# EAGLE schematic Armaz BBB Cape (EAGLE 7.3.0)

## Sheet 1 of 2
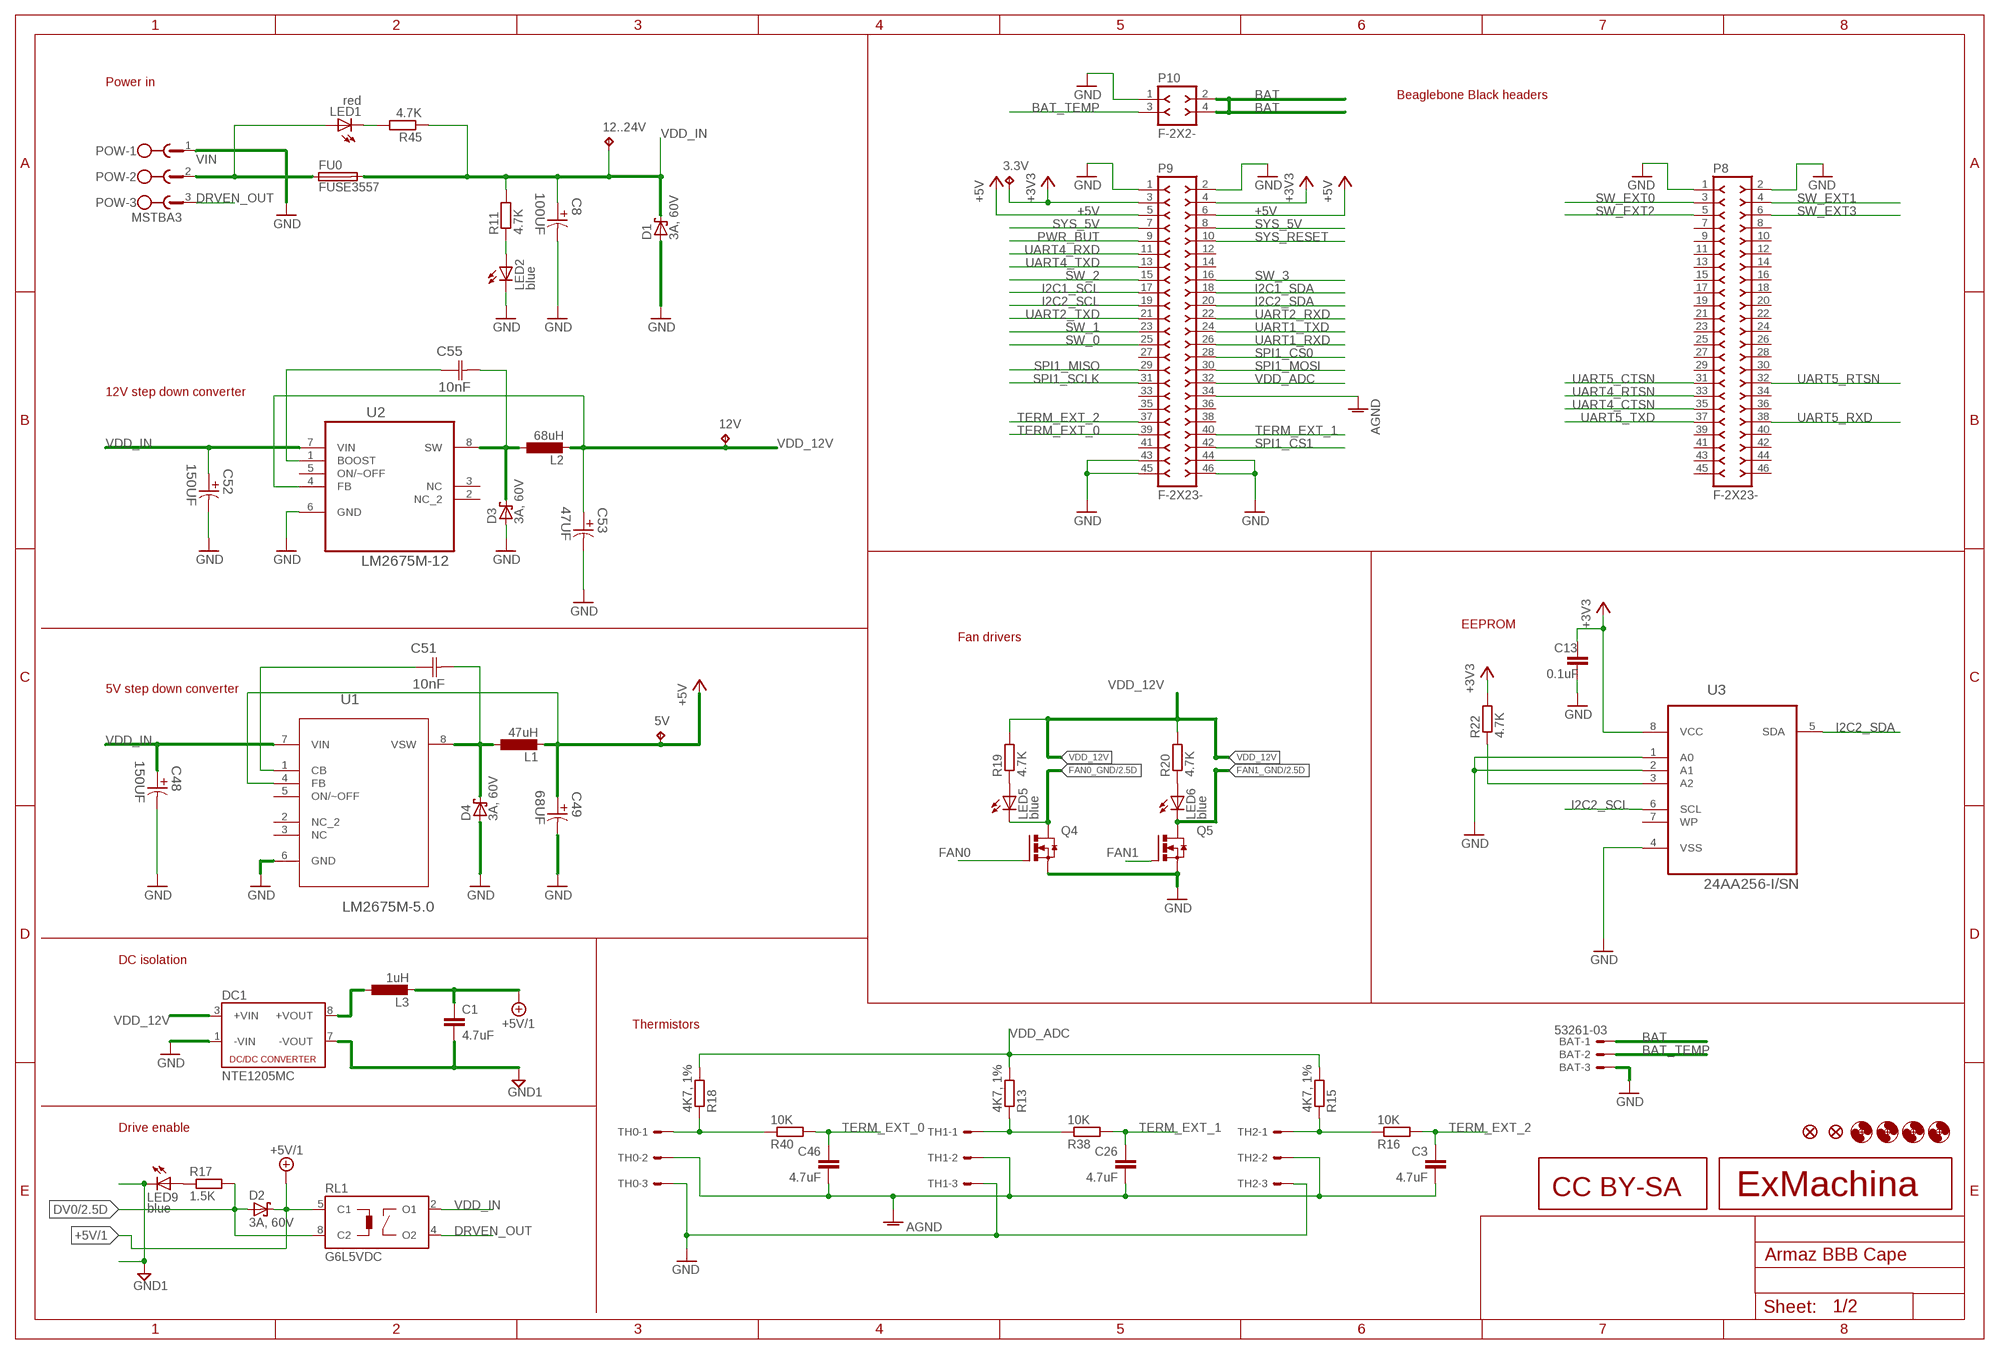
[diagram p0: schematic, sheet 1]

### Parts
3.3V  TPB1,27  [B1,27]
5V  TPB1,27  [B1,27]
12..24V  TPB1,27  [B1,27]
12V  TPB1,27  [B1,27]
BAT  53261-03  [53261-03]
C1  4.7uF  C-EUC0805  [C0805]
C3  4.7uF  C-EUC0402  [C0402]
C8  100UF  EEE-FTH101XAP-CASE-D8  [CAPAE660X800N]
C13  0.1uF  C-EUC0402  [C0402]
C26  4.7uF  C-EUC0402  [C0402]
C46  4.7uF  C-EUC0402  [C0402]
C48  150UF  EEE-FTV151XAP-CASE-D8  [CAPAE660X800N]
C49  68UF  EEE-FT1A680AR-CASE-B  [CAPAE430X610N]
C51  10nF  U0805R103KCT  [CAPC2013X90N]
C52  150UF  EEE-FTV151XAP-CASE-D8  [CAPAE660X800N]
C53  47UF  EEE-FT1E470AR-CASE-C  [CAPAE530X610N]
C55  10nF  U0805R103KCT  [CAPC2013X90N]
D1  3A, 60V  MBRS360BT3G  [SMB]
D2  3A, 60V  MBRS360BT3G  [SMB]
D3  3A, 60V  MBRS360BT3G  [SMB]
D4  3A, 60V  MBRS360BT3G  [SMB]
DC1  NTE1205MC  [NTE]
FU0  FUSE3557  [3557]
H1  MOUNT-HOLE3.3  [3,3]
H2  MOUNT-HOLE3.3  [3,3]
H3  MOUNT-HOLE3.3  [3,3]
H4  MOUNT-HOLE3.3  [3,3]
JP1  FIDUCIAL1X2  [FIDUCIAL-1X2]
JP2  FIDUCIAL1X2  [FIDUCIAL-1X2]
L1  47uH  B82462G4473M000  [B82462G4]
L2  68uH  B82462G4683M000  [B82462G4]
L3  1uH  B82462G4102M000  [B82462G4]
LED1  red  LEDCHIP-LED0603  [CHIP-LED0603]
LED2  blue  LEDCHIP-LED0603  [CHIP-LED0603]
LED5  blue  LEDCHIP-LED0603  [CHIP-LED0603]
LED6  blue  LEDCHIP-LED0603  [CHIP-LED0603]
LED9  blue  LEDCHIP-LED0603  [CHIP-LED0603]
P8  F-2X23-  [DIL-100-2X23]
P9  F-2X23-  [DIL-100-2X23]
P10  F-2X2-  [DIL-100-2X2]
POW  MSTBA3  [MSTBA3]
Q4  IRLML6344TRPBF  [SOT95P240X112-3N]
Q5  IRLML6344TRPBF  [SOT95P240X112-3N]
R11  4.7K  R-EU_R0402  [R0402]
R13  4K7, 1%  R-EU_R0402  [R0402]
R15  4K7, 1%  R-EU_R0402  [R0402]
R16  10K  R-EU_R0402  [R0402]
R17  1.5K  R-EU_R0402  [R0402]
R18  4K7, 1%  R-EU_R0402  [R0402]
R19  4.7K  R-EU_R0402  [R0402]
R20  4.7K  R-EU_R0402  [R0402]
R22  4.7K  R-EU_R0402  [R0402]
R38  10K  R-EU_R0402  [R0402]
R40  10K  R-EU_R0402  [R0402]
R45  4.7K  R-EU_R0402  [R0402]
RL1  G6L5VDC  [G6L-1F]
TH0  22-05-7038-03  [7395-03]
TH1  22-05-7038-03  [7395-03]
TH2  22-05-7038-03  [7395-03]
U1  LM2675M-5.0  [SOIC127P620X175-8N]
U2  LM2675M-12  [SOIC127P600X175-8N]
U3  24AA256-I/SN  [SOIC127P600X175-8N]
U$1  EXMACHINA-LOGO  [EXM-LOGO]
U$2  CC-BY-SA  [CC-BY-SA]

### Nets
$1 [supply]: C51.1(C1) U1.1(CB)
+3V3 [supply]: 3.3V.TP C13.1 P9.3 P9.4 R22.2 U3.8(VCC) ; also sheet 2
+5V [supply]: 5V.TP C49.1 L1.2 P9.5 P9.6 U1.4(FB) ; also sheet 2
+5V/1 [supply]: C1.1 D2.C L3.2 RL1.5(C1) ; also sheet 2
AGND: C3.2 C26.2 C46.2 P9.34 TH0.2 TH1.2 TH2.2
BAT [supply]: BAT.1 P10.2 P10.4
BAT_TEMP: BAT.2 P10.3
DRVEN_OUT [supply]: POW.3 RL1.4(O2)
DV0: D2.A R17.2 RL1.8(C2) ; also sheet 2
FAN0: Q4.1(G) ; also sheet 2
FAN0_GND [supply]: LED5.C Q4.3(D) ; also sheet 2
FAN1: Q5.1(G) ; also sheet 2
FAN1_GND [supply]: LED6.C Q5.3(D) ; also sheet 2
GND [supply]: BAT.3 C8.2 C13.2 C48.2 C49.2 C52.2 C53.2 D1.A D3.A D4.A DC1.1(-VIN) LED2.C P8.1 P8.2 P9.1 P9.2 P9.43 P9.44 P9.45 P9.46 P10.1 POW.1 Q4.2(S) Q5.2(S) TH0.3 TH1.3 TH2.3 U2.6(GND) U3.1(A0) U3.2(A1) U3.4(VSS) ; also sheet 2
GND1 [supply]: C1.2 DC1.7(-VOUT) LED9.C ; also sheet 2
I2C1_SCL: P9.17
I2C1_SDA: P9.18
I2C2_SCL: P9.19 U3.6(SCL) ; also sheet 2
I2C2_SDA: P9.20 U3.5(SDA) ; also sheet 2
N$6: LED9.A R17.1
N$8: LED1.C R45.2
N$9: LED5.A R19.1
N$21 [supply]: DC1.8(+VOUT) L3.1
N$25: R15.1 R16.1 TH2.1
N$96: LED2.A R11.1
N$117: LED6.A R20.1
N$149: R22.1 U3.3(A2)
N$237: R13.1 R38.1 TH1.1
N$240: R18.1 R40.1 TH0.1
N$245: C55.1(C1) U2.1(BOOST)
PWR_BUT: P9.9
SPI1_CS0: P9.28 ; also sheet 2
SPI1_CS1: P9.42
SPI1_MISO: P9.29 ; also sheet 2
SPI1_MOSI: P9.30 ; also sheet 2
SPI1_SCLK: P9.31 ; also sheet 2
SW [supply]: C51.2(C2) D4.C L1.1 U1.8(VSW)
SW_0: P9.25 ; also sheet 2
SW_1: P9.23 ; also sheet 2
SW_2: P9.15 ; also sheet 2
SW_3: P9.16 ; also sheet 2
SW_12V [supply]: C55.2(C2) D3.C L2.1 U2.8(SW)
SW_EXT0: P8.3 ; also sheet 2
SW_EXT1: P8.4 ; also sheet 2
SW_EXT2: P8.5 ; also sheet 2
SW_EXT3: P8.6 ; also sheet 2
SYS_5V [supply]: P9.7 P9.8 ; also sheet 2
SYS_RESET: P9.10 ; also sheet 2
TERM_EXT_0: C46.1 P9.39 R40.2
TERM_EXT_1: C26.1 P9.40 R38.2
TERM_EXT_2: C3.1 P9.37 R16.2
UART1_RXD: P9.26
UART1_TXD: P9.24
UART2_RXD: P9.22
UART2_TXD: P9.21
UART4_CTSN: P8.35
UART4_RTSN: P8.33
UART4_RXD: P9.11 ; also sheet 2
UART4_TXD: P9.13
UART5_CTSN: P8.31
UART5_RTSN: P8.32
UART5_RXD: P8.38 ; also sheet 2
UART5_TXD: P8.37 ; also sheet 2
VDD_12V [supply]: 12V.TP C53.1 DC1.3(+VIN) L2.2 R19.2 R20.2 U2.4(FB) ; also sheet 2
VDD_ADC: P9.32 R13.2 R15.2 R18.2
VDD_IN [supply]: 12..24V.TP C8.1 C48.1 C52.1 D1.C FU0.3 FU0.4 R11.2 R45.1 RL1.2(O1) U1.7(VIN) U2.7(VIN)
VIN [supply]: FU0.1 FU0.2 LED1.A POW.2
Unconnected: P8.7 P8.8 P8.9 P8.10 P8.11 P8.12 P8.13 P8.14 P8.15 P8.16 P8.17 P8.18 P8.19 P8.20 P8.21 P8.22 P8.23 P8.24 P8.25 P8.26 P8.27 P8.28 P8.29 P8.30 P8.34 P8.36 P8.39 P8.40 P8.41 P8.42 P8.43 P8.44 P8.45 P8.46 P9.12 P9.14 P9.27 P9.33 P9.35 P9.36 P9.38 P9.41 U1.2(NC_2) U1.3(NC) U1.5(ON/~OFF) U1.6(GND) U2.2(NC_2) U2.3(NC) U2.5(ON/~OFF) U3.7(WP)

### Notes on the sheet
- Power in
- Beaglebone Black headers
- 12V step down converter
- EEPROM
- Fan drivers
- 5V step down converter
- DC isolation
- Thermistors
- Drive enable

## Sheet 2 of 2
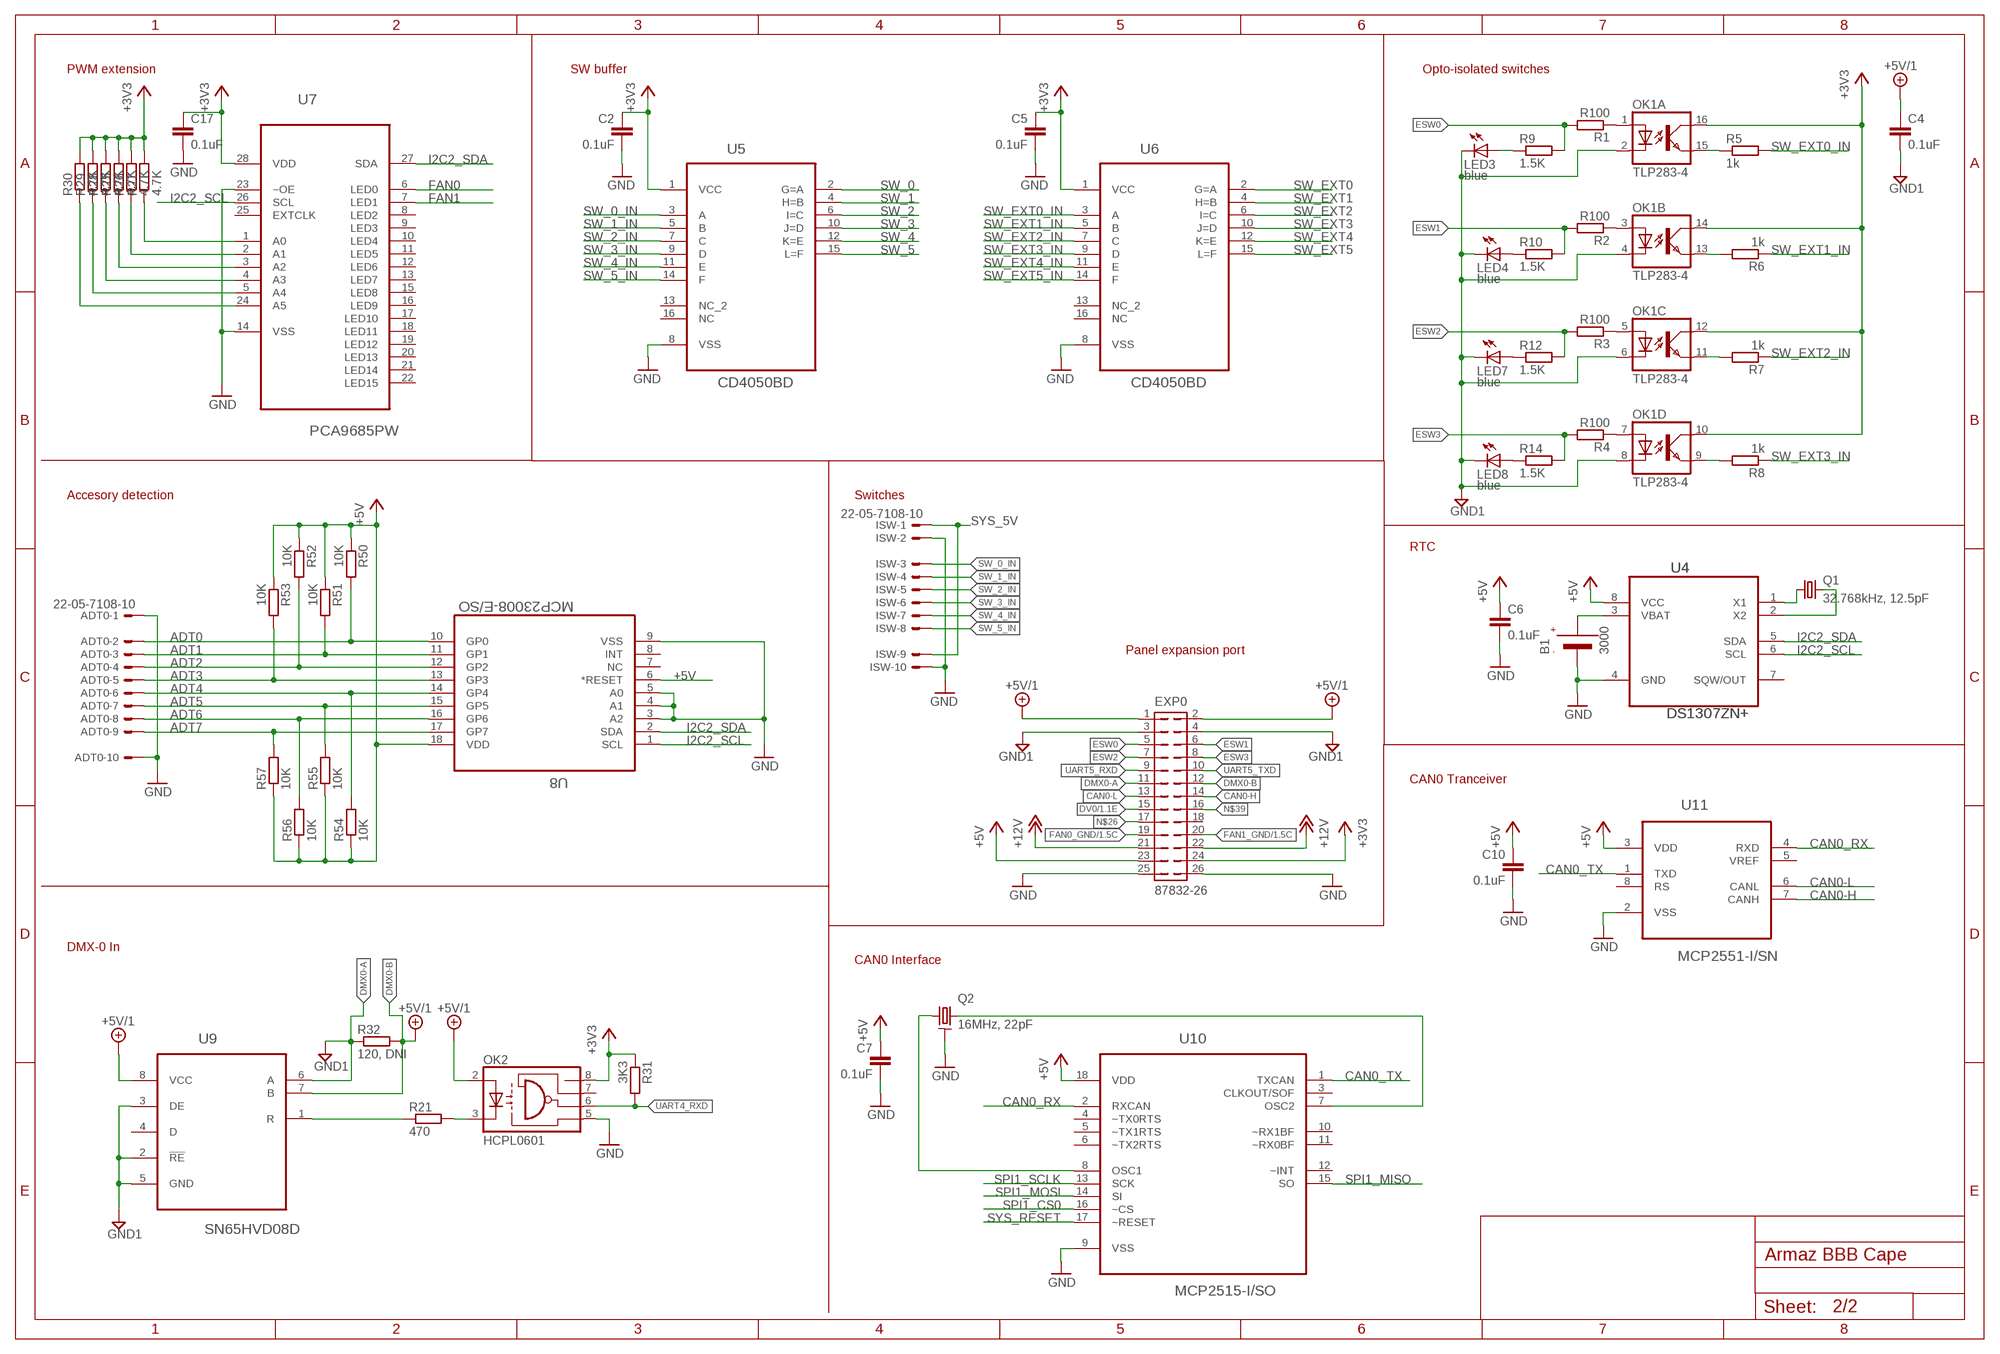
[diagram p1: schematic, sheet 2]

### Parts
ADT0  22-05-7108-10  [7395-10]
B1  3000  [3000]
C2  0.1uF  C-EUC0402  [C0402]
C4  0.1uF  C-EUC0402  [C0402]
C5  0.1uF  C-EUC0402  [C0402]
C6  0.1uF  C-EUC0402  [C0402]
C7  0.1uF  C-EUC0402  [C0402]
C10  0.1uF  C-EUC0402  [C0402]
C17  0.1uF  C-EUC0402  [C0402]
EXP0  87832-26  [87832-26]
ISW  22-05-7108-10  [7395-10]
LED3  blue  LEDCHIP-LED0603  [CHIP-LED0603]
LED4  blue  LEDCHIP-LED0603  [CHIP-LED0603]
LED7  blue  LEDCHIP-LED0603  [CHIP-LED0603]
LED8  blue  LEDCHIP-LED0603  [CHIP-LED0603]
OK1  TLP283-4  [MINI-FLAT-16]
OK2  HCPL0601  [SOIC08]
Q1  32.768kHz, 12.5pF  ABS07-32.768KHZ  [ABS07]
Q2  16MHz, 22pF  AWSCR-16MHZ-MTD-C22PF  [AWSCR-MT]
R1  R100  R-EU_R0402  [R0402]
R2  R100  R-EU_R0402  [R0402]
R3  R100  R-EU_R0402  [R0402]
R4  R100  R-EU_R0402  [R0402]
R5  1k  R-EUR0402  [R0402]
R6  1k  R-EUR0402  [R0402]
R7  1k  R-EUR0402  [R0402]
R8  1k  R-EUR0402  [R0402]
R9  1.5K  R-EU_R0402  [R0402]
R10  1.5K  R-EU_R0402  [R0402]
R12  1.5K  R-EU_R0402  [R0402]
R14  1.5K  R-EU_R0402  [R0402]
R21  470  R-EU_R0402  [R0402]
R25  4.7K  R-EU_R0402  [R0402]
R26  4.7K  R-EU_R0402  [R0402]
R27  4.7K  R-EU_R0402  [R0402]
R28  4.7K  R-EU_R0402  [R0402]
R29  4.7K  R-EU_R0402  [R0402]
R30  4.7K  R-EU_R0402  [R0402]
R31  3K3  R-EU_R0402  [R0402]
R32  120, DNI  R-EU_R0402  [R0402]
R50  10K  R-EU_R0402  [R0402]
R51  10K  R-EU_R0402  [R0402]
R52  10K  R-EU_R0402  [R0402]
R53  10K  R-EU_R0402  [R0402]
R54  10K  R-EU_R0402  [R0402]
R55  10K  R-EU_R0402  [R0402]
R56  10K  R-EU_R0402  [R0402]
R57  10K  R-EU_R0402  [R0402]
U4  DS1307ZN+  [SOIC127P600X175-8N]
U5  CD4050BD  [SOIC127P600X175-16N]
U6  CD4050BD  [SOIC127P600X175-16N]
U7  PCA9685PW  [SOP65P640X110-28N]
U8  MCP23008-E/SO  [SOIC127P1030X265-18N]
U9  SN65HVD08D  [SOIC127P600X175-8N]
U10  MCP2515-I/SO  [SOIC127P1034X264-18N]
U11  MCP2551-I/SN  [SOIC127P600X175-8N]

### Nets
+3V3 [supply]: C2.1 C5.1 C17.1 EXP0.24 OK1.10(D:COL) OK1.12(C:COL) OK1.14(B:COL) OK1.16(A:COL) OK2.8(VCC) R25.2 R26.2 R27.2 R28.2 R29.2 R30.2 R31.1 U5.1(VCC) U6.1(VCC) U7.28(VDD) ; also sheet 1
+5V [supply]: C6.1 C7.1 C10.1 EXP0.23 R50.1 R51.1 R52.1 R53.1 R54.1 R55.1 R56.1 R57.1 U4.8(VCC) U8.6(*RESET) U8.18(VDD) U10.18(VDD) U11.3(VDD) ; also sheet 1
+5V/1 [supply]: C4.1 EXP0.1 EXP0.2 OK2.2(A) U9.8(VCC) ; also sheet 1
ADT0: ADT0.2 R50.2 U8.10(GP0)
ADT1: ADT0.3 R51.2 U8.11(GP1)
ADT2: ADT0.4 R52.2 U8.12(GP2)
ADT3: ADT0.5 R53.2 U8.13(GP3)
ADT4: ADT0.6 R54.2 U8.14(GP4)
ADT5: ADT0.7 R55.2 U8.15(GP5)
ADT6: ADT0.8 R56.2 U8.16(GP6)
ADT7: ADT0.9 R57.2 U8.17(GP7)
CAN0-H: EXP0.14 U11.7(CANH)
CAN0-L: EXP0.13 U11.6(CANL)
CAN0_RX: U10.2(RXCAN) U11.4(RXD)
CAN0_TX: U10.1(TXCAN) U11.1(TXD)
DMX0-A: EXP0.11 R32.1 U9.6(A) ; supply symbol labelled GND1
DMX0-B: EXP0.12 R32.2 U9.7(B) ; supply symbol labelled +5V/1
DV0: EXP0.15 ; also sheet 1
ESW0: EXP0.5 R1.2 R9.2
ESW1: EXP0.6 R2.2 R10.2
ESW2: EXP0.7 R3.2 R12.2
ESW3: EXP0.8 R4.2 R14.2
FAN0: U7.6(LED0) ; also sheet 1
FAN0_GND [supply]: EXP0.19 ; also sheet 1
FAN1: U7.7(LED1) ; also sheet 1
FAN1_GND [supply]: EXP0.20 ; also sheet 1
GND [supply]: ADT0.1 ADT0.10 B1.-(VBAT-) C2.2 C5.2 C6.2 C7.2 C10.2 C17.2 EXP0.25 EXP0.26 ISW.2 ISW.10 OK2.5(GND) Q2.2 U4.4(GND) U5.8(VSS) U6.8(VSS) U7.14(VSS) U7.23(~OE) U8.3(A2) U8.4(A1) U8.5(A0) U8.9(VSS) U10.9(VSS) U11.2(VSS) ; also sheet 1
GND1 [supply]: C4.2 EXP0.3 EXP0.4 LED3.C LED4.C LED7.C LED8.C OK1.2(A:C) OK1.4(B:C) OK1.6(C:C) OK1.8(D:C) U9.2(!RE) U9.3(DE) U9.5(GND) ; also sheet 1
I2C2_SCL: U4.6(SCL) U7.26(SCL) U8.1(SCL) ; also sheet 1
I2C2_SDA: U4.5(SDA) U7.27(SDA) U8.2(SDA) ; also sheet 1
N$2: OK1.1(A:A) R1.1
N$3: OK1.3(B:A) R2.1
N$4: OK1.15(A:EMIT) R5.1
N$5: OK1.7(D:A) R4.1
N$7: Q1.P$1 U4.1(X1)
N$10: OK1.5(C:A) R3.1
N$11: Q1.P$2 U4.2(X2)
N$12: R21.1 U9.1(R)
N$13: OK1.9(D:EMIT) R8.2
N$14: OK1.11(C:EMIT) R7.2
N$15: OK1.13(B:EMIT) R6.2
N$16: LED3.A R9.1
N$17: OK2.3(C) R21.2
N$18: LED4.A R10.1
N$20: LED7.A R12.1
N$22: LED8.A R14.1
N$24: Q2.3 U10.7(OSC2)
N$26: EXP0.17
N$27: Q2.1 U10.8(OSC1)
N$39: EXP0.16
N$58: R27.1 U7.1(A0)
N$59: R26.1 U7.2(A1)
N$76: R25.1 U7.3(A2)
N$94: R28.1 U7.4(A3)
N$95: R29.1 U7.5(A4)
N$112: R30.1 U7.24(A5)
SPI1_CS0: U10.16(~CS) ; also sheet 1
SPI1_MISO: U10.15(SO) ; also sheet 1
SPI1_MOSI: U10.14(SI) ; also sheet 1
SPI1_SCLK: U10.13(SCK) ; also sheet 1
SW_0: U5.2(G=A) ; also sheet 1
SW_0_IN: ISW.3 U5.3(A)
SW_1: U5.4(H=B) ; also sheet 1
SW_1_IN: ISW.4 U5.5(B)
SW_2: U5.6(I=C) ; also sheet 1
SW_2_IN: ISW.5 U5.7(C)
SW_3: U5.10(J=D) ; also sheet 1
SW_3_IN: ISW.6 U5.9(D)
SW_4: U5.12(K=E)
SW_4_IN: ISW.7 U5.11(E)
SW_5: U5.15(L=F)
SW_5_IN: ISW.8 U5.14(F)
SW_EXT0: U6.2(G=A) ; also sheet 1
SW_EXT0_IN: R5.2 U6.3(A)
SW_EXT1: U6.4(H=B) ; also sheet 1
SW_EXT1_IN: R6.1 U6.5(B)
SW_EXT2: U6.6(I=C) ; also sheet 1
SW_EXT2_IN: R7.1 U6.7(C)
SW_EXT3: U6.10(J=D) ; also sheet 1
SW_EXT3_IN: R8.1 U6.9(D)
SW_EXT4: U6.12(K=E)
SW_EXT4_IN: U6.11(E)
SW_EXT5: U6.15(L=F)
SW_EXT5_IN: U6.14(F)
SYS_5V [supply]: ISW.1 ISW.9 ; also sheet 1
SYS_RESET: U10.17(~RESET) ; also sheet 1
UART4_RXD: OK2.6(VO) R31.2 ; also sheet 1
UART5_RXD: EXP0.9 ; also sheet 1
UART5_TXD: EXP0.10 ; also sheet 1
VBAT+ [supply]: B1.+1(VBAT+) B1.+2(VBAT+) U4.3(VBAT)
VDD_12V [supply]: EXP0.21 EXP0.22 ; supply symbol labelled +12V ; also sheet 1
Unconnected: EXP0.18 OK2.7(VE) U4.7(SQW/OUT) U5.13(NC_2) U5.16(NC) U6.13(NC_2) U6.16(NC) U7.8(LED2) U7.9(LED3) U7.10(LED4) U7.11(LED5) U7.12(LED6) U7.13(LED7) U7.15(LED8) U7.16(LED9) U7.17(LED10) U7.18(LED11) U7.19(LED12) U7.20(LED13) U7.21(LED14) U7.22(LED15) U7.25(EXTCLK) U8.7(NC) U8.8(INT) U9.4(D) U10.3(CLKOUT/SOF) U10.4(~TX0RTS) U10.5(~TX1RTS) U10.6(~TX2RTS) U10.10(~RX1BF) U10.11(~RX0BF) U10.12(~INT) U11.5(VREF) U11.8(RS)

### Notes on the sheet
- PWM extension | SW buffer | Opto-isolated switches
- Accesory detection | Switches
- RTC
- Panel expansion port
- CAN0 Tranceiver
- DMX-0 In
- CAN0 Interface

## Library data of the parts
3.3V 5V 12..24V 12V = testpad:TP: Test pad; OC_FARNELL: unknown
ADT0 ISW = con-molex:22-?-10: CONNECTOR wire to board 2.54 mm (.1 inch) pitch header; MF: MOLEX; MPN: 22-05-7108; OC_FARNELL: 9731660; OC_NEWARK: unknown
B1 = keystone:3000; MF: KEYSTONE; MPN: 3000; OC_FARNELL: 1650692
BAT = con-molex:53?-03: CONNECTOR wire to board 1.25 mm (.049 inch) pitch header; MF: MOLEX; MPN: 53261-0371; OC_FARNELL: 1125359; OC_NEWARK: 57H5006
C1 = rcl:C-EU: CAPACITOR, European symbol; MF: MULTICOMP; MPN: MC0805X475K6R3CT; OC_FARNELL: 1759414
C2 C4-C7 C10 C13 C17 = rcl:C-EU: CAPACITOR, European symbol; MF: MULTICOMP; MPN: MC0402B104K160CT; OC_FARNELL: 1758896
C3 C26 C46 = rcl:C-EU: CAPACITOR, European symbol; MF: MULTICOMP; MPN: MC0603X475K6R3CT; OC_FARNELL: 2320811
C8 = Panasonic-EEEFT_EEEH:EEE-: Aluminum Electrolytic Capacitors,Surface Mount Type; MF: PANASONIC ELECTRONIC COMPONENTS; MPN: EEEFTH101XAP; OC_FARNELL: 1868426; OC_NEWARK: 31T8172; PACKAGE: CASE-D8; SUPPLIER: PANASONIC; TOLERANCE: ±20 %; VOLTAGERATING: 50V
C48 C52 = Panasonic-EEEFT_EEEH:EEE-: Aluminum Electrolytic Capacitors,Surface Mount Type; MF: PANASONIC ELECTRONIC COMPONENTS; MPN: EEEFTV151XAP; OC_FARNELL: 1868418; OC_NEWARK: 31T8173; PACKAGE: CASE-D8; SUPPLIER: PANASONIC; TOLERANCE: ±20 %; VOLTAGERATING: 35V
C49 = Panasonic-EEEFT_EEEH:EEE-: Aluminum Electrolytic Capacitors,Surface Mount Type; MF: PANASONIC ELECTRONIC COMPONENTS; MPN: EEEFT1A680AR; OC_FARNELL: 2065959; OC_NEWARK: 73T9155; PACKAGE: CASE-B; SUPPLIER: PANASONIC; TOLERANCE: ±20 %; VOLTAGERATING: 10V
C51 C55 = Multicomp_By_element14_Batch_1:U0805R103KCT: CAPACITOR, 0805; MF: MULTICOMP; MPN: MCU0805R103KCT; OC_FARNELL: 9406352; OC_NEWARK: 38K9283; SUPPLIER: Multicomp; TOLERANCE: ±10%; VOLTAGERATING: 50V
C53 = Panasonic-EEEFT_EEEH:EEE-: Aluminum Electrolytic Capacitors,Surface Mount Type; MF: PANASONIC ELECTRONIC COMPONENTS; MPN: EEEFT1E470AR; OC_FARNELL: 1868404; OC_NEWARK: 31T8177; PACKAGE: CASE-C; SUPPLIER: PANASONIC; TOLERANCE: ±20 %; VOLTAGERATING: 25V
D1-D4 = ON Semiconductor_By_element14_Batch_1:MBRS360?T3G; MF: ON SEMICONDUCTOR; MPN: MBRS360BT3G; OC_FARNELL: 2317398; SUPPLIER: ON SEMICONDUCTOR
DC1 = dc-dc-converter:NTE; MF: MURATA POWER SOLUTIONS; MPN: NTE1205MC; OC_FARNELL: 1021603
EXP0 = con-molex:87832-26: Milli-Grid Header 2.00mm (.079") Pitch; MF: MOLEX; MPN: 87832-2620; OC_FARNELL: 2313712; OC_NEWARK: unknown
FU0 = fuse:FUSE: Fuse; MF: KEYSTONE; MPN: 3557; OC_FARNELL: 2292902
H1-H4 = holes:MOUNT-HOLE: MOUNTING HOLE with drill center marker; OC_FARNELL: unknown
JP1 JP2 = SparkFun:FIDUCIAL: Fiducial Alignment Points Various fiducial points for machine vision alignment.; OC_FARNELL: unknown
L1 = resistor-epcos:B82462G4?; MF: EPCOS; MPN: B82462G4473M; OC_FARNELL: 7430060
L2 = resistor-epcos:B82462G4?; MF: EPCOS; MPN: B82462G4683M; OC_FARNELL: 7430078
L3 = resistor-epcos:B82462G4?; MF: EPCOS; MPN: B82462G4102M; OC_FARNELL: 7429967
LED1 = led:LED: LED OSRAM: - CHIPLED LG R971, LG N971, LY N971, LG Q971, LY Q971, LO R971, LY R971 LH N974, LH R974 LS Q976, LO Q976, LY Q976 LO Q996 - Hyper CHIPLED LW Q18S LB Q993, LB Q99A, LB R99A - SideLED LS A670, LO A670, LY A670, LG A670, LP A670 LB A673, LV A673, LT A673, LW A673 LH A674 LY A675 LS A676, LA A676, LO A676, LY A676, LW A676 LS A679, LY A679, LG A679 - Hyper Micro SIDELED® LS Y876, LA Y876, LO Y876, LY Y876 LT Y87S - SmartLED LW L88C, LW L88S LB L89C, LB L89S, LG L890 LS L89K, LO L89K, LY L89K LS L896, LA L896, LO L896, LY L896 - TOPLED LS T670, LO T670, LY T670, LG T670, LP T670 LSG T670, LSP T670, LSY T670, LOP T670, LYG T670 LG T671, LOG T671, LSG T671 LB T673, LV T673, LT T673, LW T673 LH T674 LS T676, LA T676, LO T676, LY T676, LB T676, LH T676, LSB T676, LW T676 LB T67C, LV T67C, LT T67C, LS T67K, LO T67K, LY T67K, LW E67C LS E67B, LA E67B, LO E67B, LY E67B, LB E67C, LV E67C, LT E67C LW T67C LS T679, LY T679, LG T679 LS T770, LO T770, LY T770, LG T770, LP T770 LB T773, LV T773, LT T773, LW T773 LH T774 LS E675, LA E675, LY E675, LS T675 LS T776, LA T776, LO T776, LY T776, LB T776 LHGB T686 LT T68C, LB T68C - Hyper Mini TOPLED® LB M676 - Mini TOPLED Santana® LG M470 LS M47K, LO M47K, LY M47K Source: http://www.osram.convergy.de LUXEON: - LUMILED® LXK2-PW12-R00, LXK2-PW12-S00, LXK2-PW14-U00, LXK2-PW14-V00 LXK2-PM12-R00, LXK2-PM12-S00, LXK2-PM14-U00 LXK2-PE12-Q00, LXK2-PE12-R00, LXK2-PE12-S00, LXK2-PE14-T00, LXK2-PE14-U00 LXK2-PB12-K00, LXK2-PB12-L00, LXK2-PB12-M00, LXK2-PB14-N00, LXK2-PB14-P00, LXK2-PB14-Q00 LXK2-PR12-L00, LXK2-PR12-M00, LXK2-PR14-Q00, LXK2-PR14-R00 LXK2-PD12-Q00, LXK2-PD12-R00, LXK2-PD12-S00 LXK2-PH12-R00, LXK2-PH12-S00 LXK2-PL12-P00, LXK2-PL12-Q00, LXK2-PL12-R00 Source: www.luxeon.com KINGBRIGHT: KA-3528ASYC Source: www.kingbright.com; MF: MULTICOMP; MPN: OVS-0608; OC_FARNELL: 1716774
LED2-LED9 = led:LED: LED OSRAM: - CHIPLED LG R971, LG N971, LY N971, LG Q971, LY Q971, LO R971, LY R971 LH N974, LH R974 LS Q976, LO Q976, LY Q976 LO Q996 - Hyper CHIPLED LW Q18S LB Q993, LB Q99A, LB R99A - SideLED LS A670, LO A670, LY A670, LG A670, LP A670 LB A673, LV A673, LT A673, LW A673 LH A674 LY A675 LS A676, LA A676, LO A676, LY A676, LW A676 LS A679, LY A679, LG A679 - Hyper Micro SIDELED® LS Y876, LA Y876, LO Y876, LY Y876 LT Y87S - SmartLED LW L88C, LW L88S LB L89C, LB L89S, LG L890 LS L89K, LO L89K, LY L89K LS L896, LA L896, LO L896, LY L896 - TOPLED LS T670, LO T670, LY T670, LG T670, LP T670 LSG T670, LSP T670, LSY T670, LOP T670, LYG T670 LG T671, LOG T671, LSG T671 LB T673, LV T673, LT T673, LW T673 LH T674 LS T676, LA T676, LO T676, LY T676, LB T676, LH T676, LSB T676, LW T676 LB T67C, LV T67C, LT T67C, LS T67K, LO T67K, LY T67K, LW E67C LS E67B, LA E67B, LO E67B, LY E67B, LB E67C, LV E67C, LT E67C LW T67C LS T679, LY T679, LG T679 LS T770, LO T770, LY T770, LG T770, LP T770 LB T773, LV T773, LT T773, LW T773 LH T774 LS E675, LA E675, LY E675, LS T675 LS T776, LA T776, LO T776, LY T776, LB T776 LHGB T686 LT T68C, LB T68C - Hyper Mini TOPLED® LB M676 - Mini TOPLED Santana® LG M470 LS M47K, LO M47K, LY M47K Source: http://www.osram.convergy.de LUXEON: - LUMILED® LXK2-PW12-R00, LXK2-PW12-S00, LXK2-PW14-U00, LXK2-PW14-V00 LXK2-PM12-R00, LXK2-PM12-S00, LXK2-PM14-U00 LXK2-PE12-Q00, LXK2-PE12-R00, LXK2-PE12-S00, LXK2-PE14-T00, LXK2-PE14-U00 LXK2-PB12-K00, LXK2-PB12-L00, LXK2-PB12-M00, LXK2-PB14-N00, LXK2-PB14-P00, LXK2-PB14-Q00 LXK2-PR12-L00, LXK2-PR12-M00, LXK2-PR14-Q00, LXK2-PR14-R00 LXK2-PD12-Q00, LXK2-PD12-R00, LXK2-PD12-S00 LXK2-PH12-R00, LXK2-PH12-S00 LXK2-PL12-P00, LXK2-PL12-Q00, LXK2-PL12-R00 Source: www.luxeon.com KINGBRIGHT: KA-3528ASYC Source: www.kingbright.com; MF: MULTICOMP; MPN: OVS-0603; OC_FARNELL: 1716770
OK1 = optocoupler:TLP283-4: TOSHIBA PHOTOCOUPLER GaAs IRED & PHOTO-TRANSISTOR Source: http://www.semicon.toshiba.co.jp/td/en/Opto/Photocoupler/en_20050928_TLP283_datasheet.pdf; MF: VISHAY; MPN: TCMT4100; OC_FARNELL: 1779650; OC_NEWARK: unknown
OK2 = optocoupler:HCPL0601: HEWLETT PACKARD OPTO COUPLER; MF: AVAGO TECHNOLOGIES; MPN: HCPL-0601-000E; OC_FARNELL: 9995102; OC_NEWARK: 88H7776
P8 P9 = con-headers-jp:F-2X23-; MF: SAMTEC; MPN: ESQ-123-14-T-D; OC_FARNELL: 1932255
P10 = con-headers-jp:F-2X2-; MF: SAMTEC; MPN: TSW-104-14-T-D; OC_FARNELL: 2027226
POW = con-phoenix-508:MSTBA3: PHOENIX; MF: PHOENIX CONTACT; MPN: 1757255; OC_FARNELL: 3705183; OC_NEWARK: 71C4162
Q1 = crystal:ABS07-?; MF: ABRACON; MPN: ABS07-32.768KHZ-T; OC_FARNELL: 2101347
Q2 = crystal:AWSCR-?; MF: ABRACON; MPN: AWSCR-16.00MTD-T; OC_FARNELL: 2101362
Q4 Q5 = International_Rectifier_By_element14_Batch_1:IRLML6344TRPBF: Power MOSFET; MF: INTERNATIONAL RECTIFIER; MPN: IRLML6344TRPBF; OC_FARNELL: 1857299; OC_NEWARK: 25T5501; PACKAGE: SOT-23-3; SUPPLIER: INTERNATIONAL RECTIFIER
R1-R4 = rcl:R-EU_: RESISTOR, European symbol; MF: MULTICOMP; MPN: MCMR04X1000FTL; OC_FARNELL: 2072515
R5-R8 = rcl-2:R-EU: RESISTOR, European symbol; MF: MULTICOMP; MPN: MCMR04X1001FTL; OC_FARNELL: 2072516
R9 R10 R12 R14 R17 = rcl:R-EU_: RESISTOR, European symbol; MF: MULTICOMP; MPN: MCMR04X1501FTL; OC_FARNELL: 2072645
R11 R13 R15 R18-R20 R22 R25-R30 R45 = rcl:R-EU_: RESISTOR, European symbol; MF: MULTICOMP; MPN: MCMR04X4701FTL; OC_FARNELL: 2073064
R16 R38 R40 R50-R57 = rcl:R-EU_: RESISTOR, European symbol; MF: MULTICOMP; MPN: MCMR04X1002FTL; OC_FARNELL: 2072517
R21 = rcl:R-EU_: RESISTOR, European symbol; MF: MULTICOMP; MPN: MCMR04X4700FTL; OC_FARNELL: 2073063
R31 = rcl:R-EU_: RESISTOR, European symbol; MF: MULTICOMP; MPN: MCMR04X3301FTL; OC_FARNELL: 2072928
R32 = rcl:R-EU_: RESISTOR, European symbol; MF: MULTICOMP; MPN: MCMR04X1200FTL; OC_FARNELL: 2072575
RL1 = rel-omron:G6L; MF: OMRON ELECTRONIC COMPONENTS; MPN: G6L1F5DC; OC_FARNELL: 2213840
TH0 TH1 TH2 = con-molex:22-?-03: CONNECTOR wire to board 2.54 mm (.1 inch) pitch header; MF: MOLEX; MPN: 22-05-7038; OC_FARNELL: 9731610; OC_NEWARK: unknown
U1 = NSC_By_element14_Batch_1.1:LM2675M-5.0: Step-Down Voltage Regulator; MF: TEXAS INSTRUMENTS; MPN: LM2675M-5.0; OC_FARNELL: 9489746; OC_NEWARK: 41K4141; PACKAGE: 8-SOIC; SUPPLIER: National Semiconductors
U2 = NSC_By_element14_Batch_1.1:LM2675M-12: IC REG SIMPLE SWITCHER; MF: TEXAS INSTRUMENTS; MPN: LM2675M-12/NOPB; OC_FARNELL: 1469208; OC_NEWARK: 41K4139; PACKAGE: 8-SOIC; SUPPLIER: National Semiconductor
U3 = Microchip_By_element14_Batch_1:24AA256-I/SN: EEPROM; MF: MICROCHIP; MPN: 24AA256-I/SN; OC_FARNELL: 1331295; OC_NEWARK: 92C6874; PACKAGE: SOIC-8; SUPPLIER: MICROCHIP
U4 = maxim:DS1307ZN+: 64 x 8, Serial, I2C Real-Time Clock; MF: MAXIM INTEGRATED PRODUCTS; MPN: DS1307ZN+; OC_FARNELL: 9725253; OC_NEWARK: 96K8872; PACKAGE: SOIC-8; SUPPLIER: Maxim
U5 U6 = ti:CD4050BD: CMOS Hex Buffer/Converters; MF: TEXAS INSTRUMENTS; MPN: CD4050BD; OC_FARNELL: 1740857; OC_NEWARK: 50R5062; PACKAGE: 16-SOIC; SUPPLIER: Texas Instruments
U7 = custom:PCA9685PW: 16-channel, 12-bit PWM Fm+ I2C-bus LED controller; MF: NXP; MPN: PCA9685PW; OC_FARNELL: 1854074; OC_NEWARK: 19T6398; PACKAGE: TSSOP-28; SUPPLIER: NXP
U8 = microchip:MCP23008-E/SO: 8BIT EXPANDER, I/O, I2C I/F; MF: MICROCHIP; MPN: MCP23008-E/SO; OC_FARNELL: 1332086; OC_NEWARK: 08J8738; PACKAGE: SOIC-18 -Wide; SUPPLIER: Microchip
U9 = ti:SN65HVD08D: WIDE SUPPLY RANGE RS-485 TRANSCEIVER; MF: TEXAS INSTRUMENTS; MPN: SN65HVD08D; OC_FARNELL: 1212360; OC_NEWARK: 17M9320; PACKAGE: SOIC-8; SUPPLIER: Texas Instruments
U10 = Microchip_By_element14_Batch_1:MCP2515-I/SO: CAN Controller; MF: MICROCHIP; MPN: MCP2515-I/SO; OC_FARNELL: 1292239; OC_NEWARK: 29H7136; PACKAGE: SOIC-18; SUPPLIER: Microchip
U11 = Microchip_By_element14_Batch_1:MCP2551-I/SN: High-Speed CAN Transceiver; MF: MICROCHIP; MPN: MCP2551-I/SN; OC_FARNELL: 9758569; OC_NEWARK: 69K7604; PACKAGE: SOIC-8; SUPPLIER: Microchip
U$1 = exmachina:EXMACHINA-LOGO; OC_FARNELL: unknown
U$2 = cc-by-sa:CC-BY-SA; OC_FARNELL: unknown

## Net classes
0 default: width 0.152 mm, drill 0.2 mm, clearance 0.205 mm
1 supply: width 0.406 mm, drill 0.35 mm, clearance 0.205 mm to class 0, clearance 0.205 mm